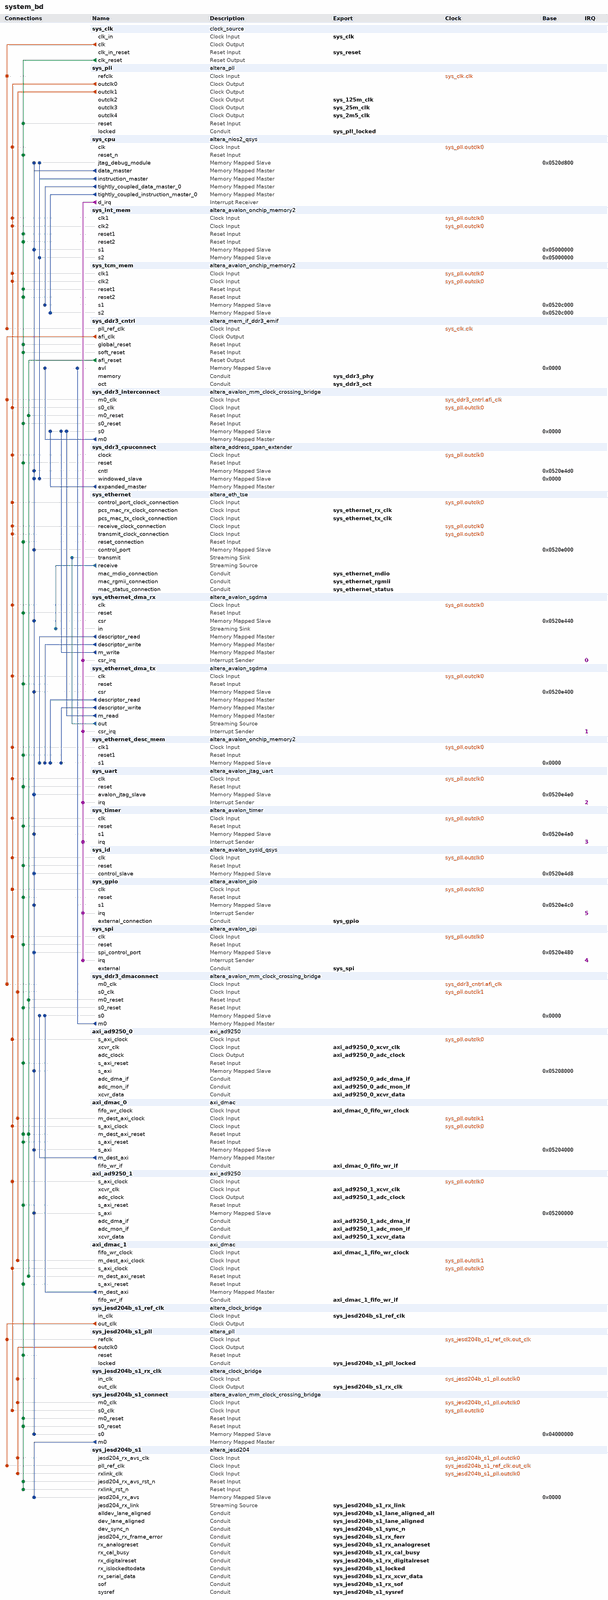
[diagram p0: system contents, whole]
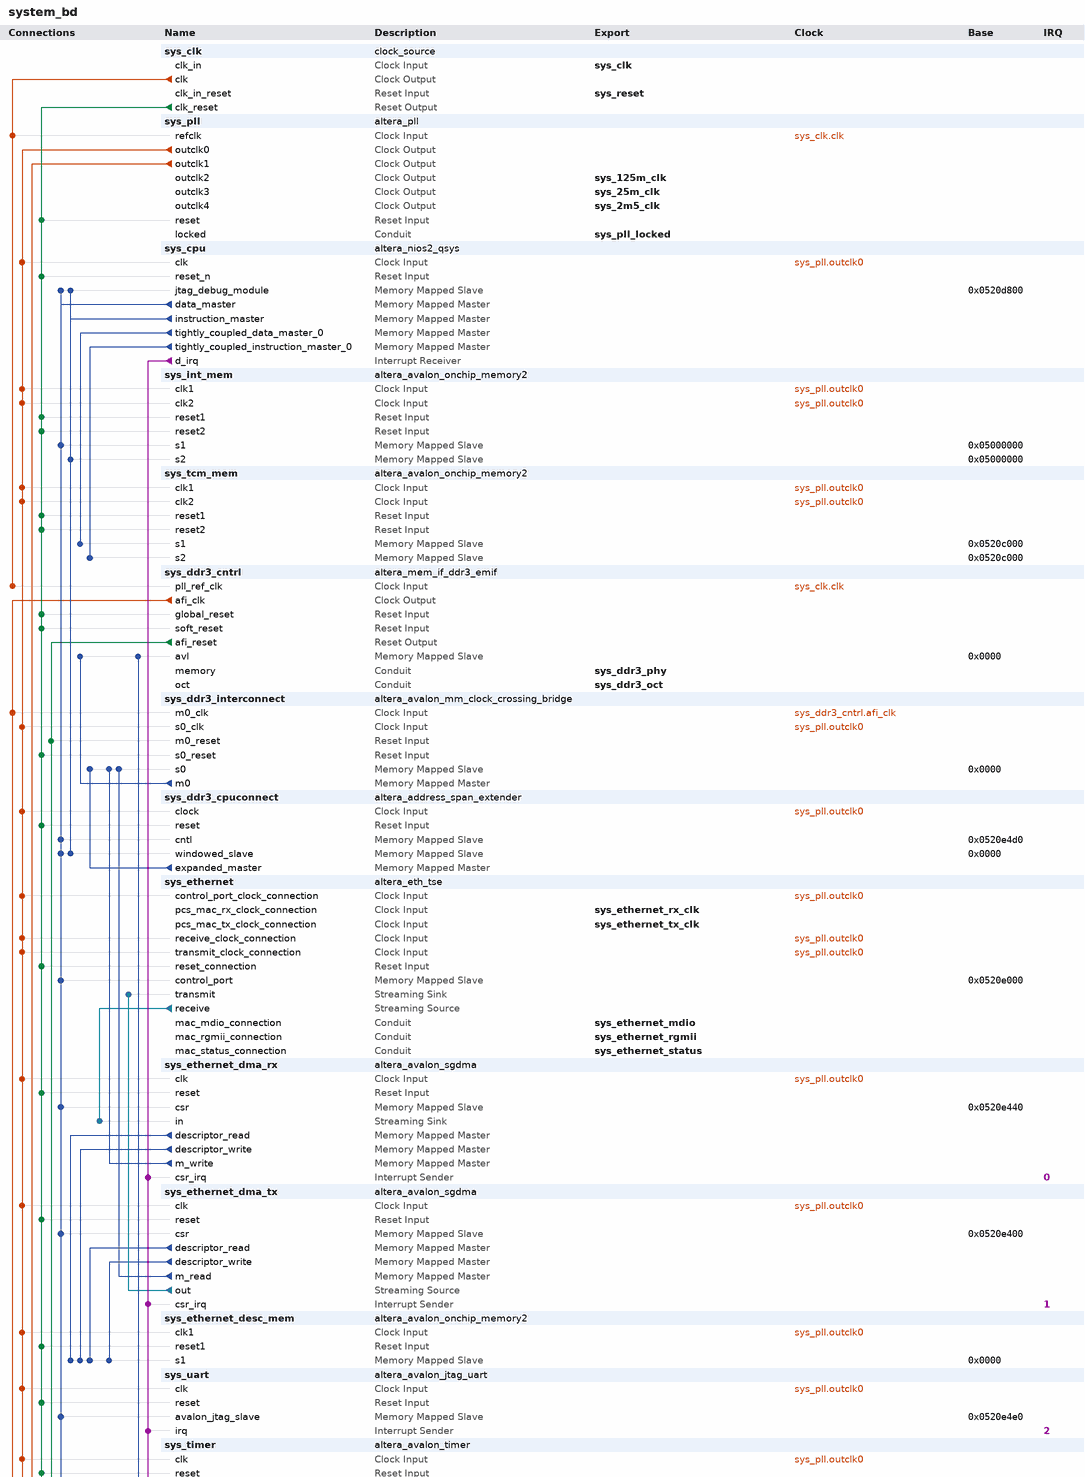
[diagram p1: system contents, upper part]
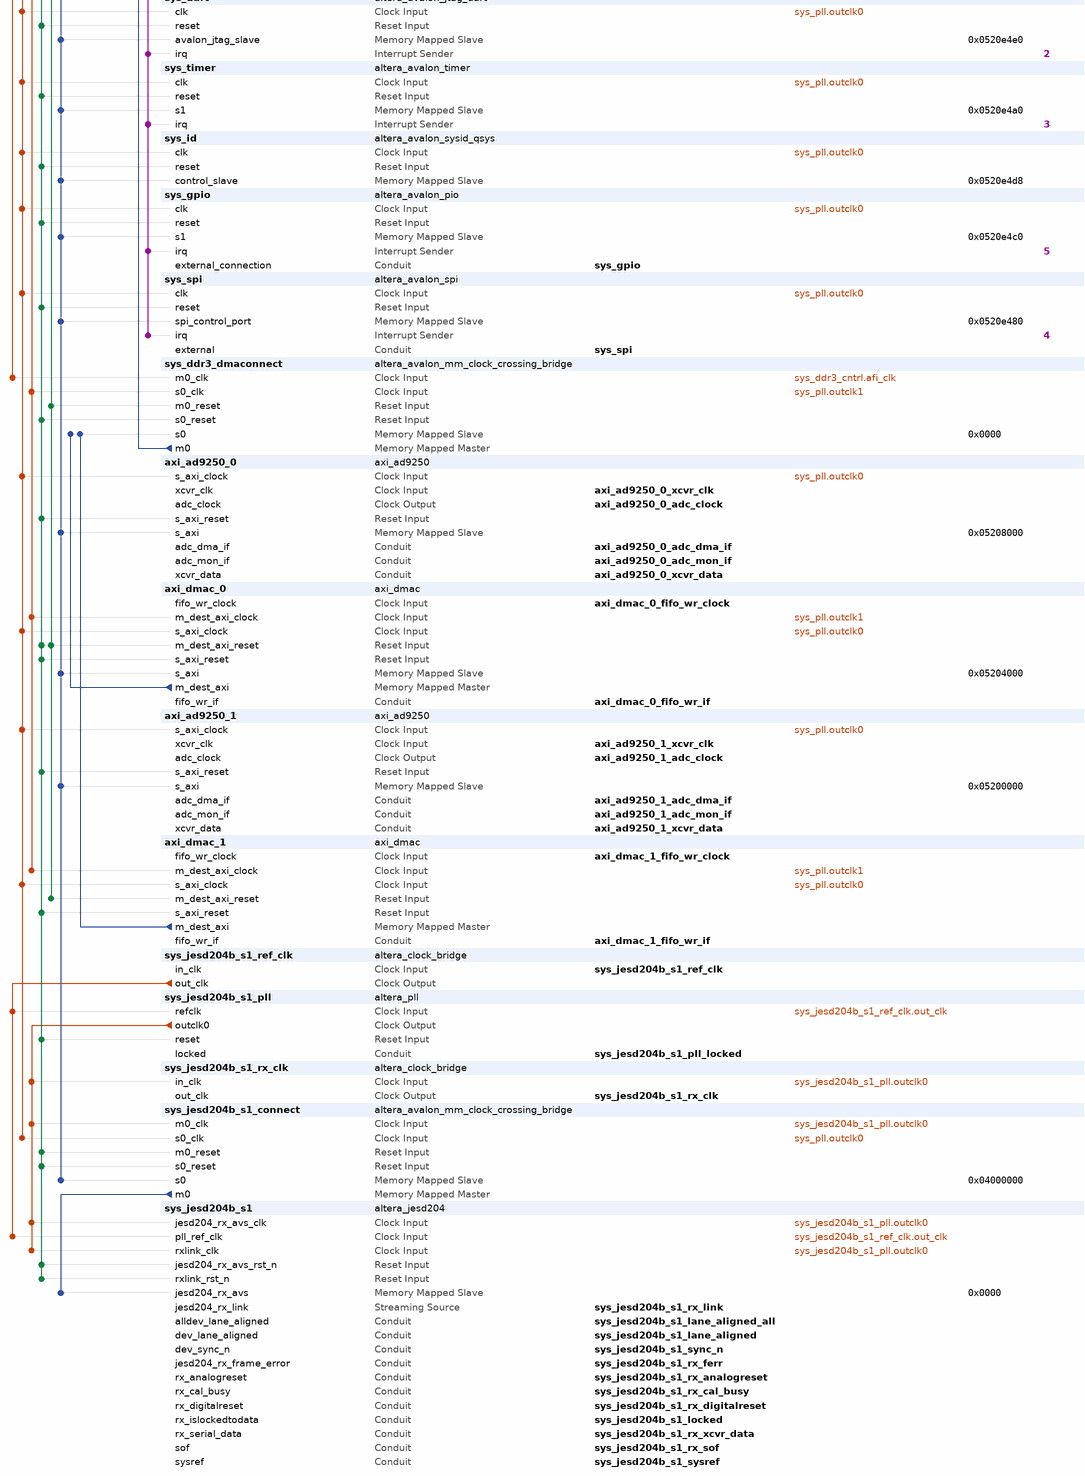
[diagram p2: system contents, lower part]
# Platform Designer (Qsys) system system_bd, Arria V 5AGTFD7K3F40I3
# Parameters at their usual value, and those the tool derives, are not listed.
package require -exact qsys 13.1
create_system system_bd
set_project_property DEVICE_FAMILY {Arria V}
set_project_property DEVICE 5AGTFD7K3F40I3

add_instance sys_clk clock_source 13.1
set_instance_parameter_value sys_clk clockFrequency 50000000

add_instance sys_pll altera_pll 13.1
set_instance_parameter_value sys_pll gui_device_speed_grade 2
set_instance_parameter_value sys_pll gui_pll_mode {Integer-N PLL}
set_instance_parameter_value sys_pll gui_reference_clock_frequency 100.0
set_instance_parameter_value sys_pll gui_operation_mode direct
set_instance_parameter_value sys_pll gui_use_locked true
set_instance_parameter_value sys_pll gui_number_of_clocks 5
set_instance_parameter_value sys_pll gui_output_clock_frequency0 100.0
set_instance_parameter_value sys_pll gui_output_clock_frequency1 166.666666
set_instance_parameter_value sys_pll gui_actual_output_clock_frequency1 {166.666666 MHz}
set_instance_parameter_value sys_pll gui_output_clock_frequency2 125.0
set_instance_parameter_value sys_pll gui_output_clock_frequency3 25.0

add_instance sys_cpu altera_nios2_qsys 13.1
set_instance_parameter_value sys_cpu mpu_enabled true
set_instance_parameter_value sys_cpu mmu_TLBMissExcOffset 4096
set_instance_parameter_value sys_cpu resetSlave sys_int_mem.s2
set_instance_parameter_value sys_cpu mmu_TLBMissExcSlave sys_int_mem.s2
set_instance_parameter_value sys_cpu exceptionSlave sys_int_mem.s2
set_instance_parameter_value sys_cpu breakSlave sys_cpu.jtag_debug_module
set_instance_parameter_value sys_cpu muldiv_multiplierType DSPBlock
set_instance_parameter_value sys_cpu impl Fast
set_instance_parameter_value sys_cpu icache_size 4096
set_instance_parameter_value sys_cpu icache_numTCIM 1
set_instance_parameter_value sys_cpu dcache_numTCDM 1

add_instance sys_int_mem altera_avalon_onchip_memory2 13.1
set_instance_parameter_value sys_int_mem dataWidth 32
set_instance_parameter_value sys_int_mem dualPort true
set_instance_parameter_value sys_int_mem initMemContent true
set_instance_parameter_value sys_int_mem initializationFileName onchip_mem.hex
set_instance_parameter_value sys_int_mem memorySize 1572864

add_instance sys_tcm_mem altera_avalon_onchip_memory2 13.1
set_instance_parameter_value sys_tcm_mem dataWidth 32
set_instance_parameter_value sys_tcm_mem dualPort true
set_instance_parameter_value sys_tcm_mem initMemContent true
set_instance_parameter_value sys_tcm_mem initializationFileName onchip_mem.hex
set_instance_parameter_value sys_tcm_mem memorySize 4096

add_instance sys_ddr3_cntrl altera_mem_if_ddr3_emif 13.1
set_instance_parameter_value sys_ddr3_cntrl MEM_VENDOR Micron
set_instance_parameter_value sys_ddr3_cntrl MEM_FORMAT DISCRETE
set_instance_parameter_value sys_ddr3_cntrl MEM_CLK_FREQ_MAX 800.0
set_instance_parameter_value sys_ddr3_cntrl MEM_ROW_ADDR_WIDTH 14
set_instance_parameter_value sys_ddr3_cntrl MEM_COL_ADDR_WIDTH 10
set_instance_parameter_value sys_ddr3_cntrl MEM_DQ_WIDTH 64
set_instance_parameter_value sys_ddr3_cntrl MEM_BANKADDR_WIDTH 3
set_instance_parameter_value sys_ddr3_cntrl MEM_DRV_STR RZQ/6
set_instance_parameter_value sys_ddr3_cntrl MEM_WTCL 8
set_instance_parameter_value sys_ddr3_cntrl MEM_TCL 11
set_instance_parameter_value sys_ddr3_cntrl TIMING_TIS 170
set_instance_parameter_value sys_ddr3_cntrl TIMING_TIH 120
set_instance_parameter_value sys_ddr3_cntrl TIMING_TDS 10
set_instance_parameter_value sys_ddr3_cntrl TIMING_TDH 45
set_instance_parameter_value sys_ddr3_cntrl TIMING_TDQSQ 100
set_instance_parameter_value sys_ddr3_cntrl TIMING_TDQSCK 255
set_instance_parameter_value sys_ddr3_cntrl TIMING_TDQSS 0.27
set_instance_parameter_value sys_ddr3_cntrl TIMING_TQSH 0.4
set_instance_parameter_value sys_ddr3_cntrl TIMING_TDSH 0.18
set_instance_parameter_value sys_ddr3_cntrl TIMING_TDSS 0.18
set_instance_parameter_value sys_ddr3_cntrl MEM_TRAS_NS 35.0
set_instance_parameter_value sys_ddr3_cntrl MEM_TRCD_NS 13.75
set_instance_parameter_value sys_ddr3_cntrl MEM_TRP_NS 13.75
set_instance_parameter_value sys_ddr3_cntrl MEM_TRFC_NS 110.0
set_instance_parameter_value sys_ddr3_cntrl MEM_TWTR 6
set_instance_parameter_value sys_ddr3_cntrl MEM_TFAW_NS 30.0
set_instance_parameter_value sys_ddr3_cntrl MEM_TRRD_NS 6.0
set_instance_parameter_value sys_ddr3_cntrl MEM_TRTP_NS 7.5
set_instance_parameter_value sys_ddr3_cntrl RATE Quarter
set_instance_parameter_value sys_ddr3_cntrl MEM_CLK_FREQ 400.0
set_instance_parameter_value sys_ddr3_cntrl SPEED_GRADE 3
set_instance_parameter_value sys_ddr3_cntrl HARD_EMIF false
set_instance_parameter_value sys_ddr3_cntrl POWER_OF_TWO_BUS false
set_instance_parameter_value sys_ddr3_cntrl AVL_MAX_SIZE 256
set_instance_parameter_value sys_ddr3_cntrl PRIORITY_PORT 1,1,1,1,1,1
set_instance_parameter_value sys_ddr3_cntrl CPORT_TYPE_PORT Bidirectional,Bidirectional,Bidirectional,Bidirectional,Bidirectional,Bidirectional
set_instance_parameter_value sys_ddr3_cntrl REF_CLK_FREQ 100.0
set_instance_parameter_value sys_ddr3_cntrl DEFAULT_FAST_SIM_MODEL true
set_instance_parameter_value sys_ddr3_cntrl EXPORT_AFI_HALF_CLK false
set_instance_parameter_value sys_ddr3_cntrl PLL_LOCATION Top_Bottom
set_instance_parameter_value sys_ddr3_cntrl CALIBRATION_MODE Skip
set_instance_parameter_value sys_ddr3_cntrl USER_DEBUG_LEVEL 1
set_instance_parameter_value sys_ddr3_cntrl TIMING_BOARD_MAX_CK_DELAY 0.6
set_instance_parameter_value sys_ddr3_cntrl TIMING_BOARD_MAX_DQS_DELAY 0.6
set_instance_parameter_value sys_ddr3_cntrl TIMING_BOARD_SKEW_CKDQS_DIMM_MIN -0.01
set_instance_parameter_value sys_ddr3_cntrl TIMING_BOARD_SKEW_CKDQS_DIMM_MAX 0.01
set_instance_parameter_value sys_ddr3_cntrl TIMING_BOARD_SKEW_WITHIN_DQS 0.02
set_instance_parameter_value sys_ddr3_cntrl TIMING_BOARD_SKEW_BETWEEN_DQS 0.02
set_instance_parameter_value sys_ddr3_cntrl TIMING_BOARD_DQ_TO_DQS_SKEW 0.0
set_instance_parameter_value sys_ddr3_cntrl TIMING_BOARD_AC_SKEW 0.02
set_instance_parameter_value sys_ddr3_cntrl TIMING_BOARD_AC_TO_CK_SKEW 0.0

add_instance sys_ddr3_interconnect altera_avalon_mm_clock_crossing_bridge 13.1
set_instance_parameter_value sys_ddr3_interconnect DATA_WIDTH 512
set_instance_parameter_value sys_ddr3_interconnect ADDRESS_WIDTH 30
set_instance_parameter_value sys_ddr3_interconnect MAX_BURST_SIZE 1
set_instance_parameter_value sys_ddr3_interconnect COMMAND_FIFO_DEPTH 4
set_instance_parameter_value sys_ddr3_interconnect RESPONSE_FIFO_DEPTH 4
set_instance_parameter_value sys_ddr3_interconnect MASTER_SYNC_DEPTH 2
set_instance_parameter_value sys_ddr3_interconnect SLAVE_SYNC_DEPTH 2

add_instance sys_ddr3_cpuconnect altera_address_span_extender 1.2
set_instance_parameter_value sys_ddr3_cpuconnect DATA_WIDTH 512
set_instance_parameter_value sys_ddr3_cpuconnect MASTER_ADDRESS_WIDTH 30
set_instance_parameter_value sys_ddr3_cpuconnect SLAVE_ADDRESS_WIDTH 20
set_instance_parameter_value sys_ddr3_cpuconnect BURSTCOUNT_WIDTH 1
set_instance_parameter_value sys_ddr3_cpuconnect MASTER_ADDRESS_DEF 0
set_instance_parameter_value sys_ddr3_cpuconnect TERMINATE_SLAVE_PORT false
set_instance_parameter_value sys_ddr3_cpuconnect MAX_PENDING_READS 1

add_instance sys_ethernet altera_eth_tse 13.1
set_instance_parameter_value sys_ethernet core_variation MAC_ONLY
set_instance_parameter_value sys_ethernet ifGMII RGMII
set_instance_parameter_value sys_ethernet transceiver_type NONE
set_instance_parameter_value sys_ethernet enable_hd_logic true
set_instance_parameter_value sys_ethernet stat_cnt_ena true
set_instance_parameter_value sys_ethernet enable_shift16 true
set_instance_parameter_value sys_ethernet enable_mac_flow_ctrl true
set_instance_parameter_value sys_ethernet enable_magic_detect true
set_instance_parameter_value sys_ethernet mdio_clk_div 30
set_instance_parameter_value sys_ethernet ing_addr 11

add_instance sys_ethernet_dma_rx altera_avalon_sgdma 13.1
set_instance_parameter_value sys_ethernet_dma_rx enableBurstTransfers false
set_instance_parameter_value sys_ethernet_dma_rx enableUnalignedTransfers false
set_instance_parameter_value sys_ethernet_dma_rx readBlockDataWidth 32
set_instance_parameter_value sys_ethernet_dma_rx sinkErrorWidth 0
set_instance_parameter_value sys_ethernet_dma_rx sourceErrorWidth 0
set_instance_parameter_value sys_ethernet_dma_rx transferMode STREAM_TO_MEMORY
set_instance_parameter_value sys_ethernet_dma_rx writeBurstcountWidth 4

add_instance sys_ethernet_dma_tx altera_avalon_sgdma 13.1
set_instance_parameter_value sys_ethernet_dma_tx enableBurstTransfers false
set_instance_parameter_value sys_ethernet_dma_tx enableUnalignedTransfers false
set_instance_parameter_value sys_ethernet_dma_tx readBlockDataWidth 32
set_instance_parameter_value sys_ethernet_dma_tx sinkErrorWidth 0
set_instance_parameter_value sys_ethernet_dma_tx sourceErrorWidth 0
set_instance_parameter_value sys_ethernet_dma_tx transferMode MEMORY_TO_STREAM
set_instance_parameter_value sys_ethernet_dma_tx writeBurstcountWidth 4

add_instance sys_ethernet_desc_mem altera_avalon_onchip_memory2 13.1
set_instance_parameter_value sys_ethernet_desc_mem dataWidth 32
set_instance_parameter_value sys_ethernet_desc_mem dualPort false
set_instance_parameter_value sys_ethernet_desc_mem initMemContent true
set_instance_parameter_value sys_ethernet_desc_mem initializationFileName onchip_mem.hex
set_instance_parameter_value sys_ethernet_desc_mem memorySize 4096

add_instance sys_uart altera_avalon_jtag_uart 13.1
set_instance_parameter_value sys_uart simInteractiveOptions NO_INTERACTIVE_WINDOWS

add_instance sys_timer altera_avalon_timer 13.1
set_instance_parameter_value sys_timer period 1
set_instance_parameter_value sys_timer periodUnits MSEC

add_instance sys_id altera_avalon_sysid_qsys 13.1
set_instance_parameter_value sys_id id 0

add_instance sys_gpio altera_avalon_pio 13.1
set_instance_parameter_value sys_gpio direction InOut
set_instance_parameter_value sys_gpio generateIRQ true
set_instance_parameter_value sys_gpio width 32

add_instance sys_spi altera_avalon_spi 13.1
set_instance_parameter_value sys_spi clockPolarity 0
set_instance_parameter_value sys_spi dataWidth 8
set_instance_parameter_value sys_spi masterSPI true
set_instance_parameter_value sys_spi numberOfSlaves 1
set_instance_parameter_value sys_spi targetClockRate 128000

add_instance sys_ddr3_dmaconnect altera_avalon_mm_clock_crossing_bridge 13.1
set_instance_parameter_value sys_ddr3_dmaconnect DATA_WIDTH 512
set_instance_parameter_value sys_ddr3_dmaconnect ADDRESS_WIDTH 30
set_instance_parameter_value sys_ddr3_dmaconnect MAX_BURST_SIZE 1
set_instance_parameter_value sys_ddr3_dmaconnect COMMAND_FIFO_DEPTH 4
set_instance_parameter_value sys_ddr3_dmaconnect RESPONSE_FIFO_DEPTH 4
set_instance_parameter_value sys_ddr3_dmaconnect MASTER_SYNC_DEPTH 2
set_instance_parameter_value sys_ddr3_dmaconnect SLAVE_SYNC_DEPTH 2

add_instance axi_ad9250_0 axi_ad9250 1.0
set_instance_parameter_value axi_ad9250_0 PCORE_ID 0
set_instance_parameter_value axi_ad9250_0 PCORE_DEVICE_TYPE 0

add_instance axi_dmac_0 axi_dmac 1.0
set_instance_parameter_value axi_dmac_0 PCORE_ID 0
set_instance_parameter_value axi_dmac_0 C_DMA_DATA_WIDTH_SRC 64
set_instance_parameter_value axi_dmac_0 C_DMA_DATA_WIDTH_DEST 64
set_instance_parameter_value axi_dmac_0 C_ADDR_ALIGN_BITS 3
set_instance_parameter_value axi_dmac_0 C_DMA_LENGTH_WIDTH 14
set_instance_parameter_value axi_dmac_0 C_2D_TRANSFER 1
set_instance_parameter_value axi_dmac_0 C_CLKS_ASYNC_REQ_SRC 1
set_instance_parameter_value axi_dmac_0 C_CLKS_ASYNC_SRC_DEST 1
set_instance_parameter_value axi_dmac_0 C_CLKS_ASYNC_DEST_REQ 1
set_instance_parameter_value axi_dmac_0 C_AXI_SLICE_DEST 0
set_instance_parameter_value axi_dmac_0 C_AXI_SLICE_SRC 0
set_instance_parameter_value axi_dmac_0 C_SYNC_TRANSFER_START 0
set_instance_parameter_value axi_dmac_0 C_CYCLIC 1
set_instance_parameter_value axi_dmac_0 C_DMA_TYPE_DEST 0
set_instance_parameter_value axi_dmac_0 C_DMA_TYPE_SRC 2

add_instance axi_ad9250_1 axi_ad9250 1.0
set_instance_parameter_value axi_ad9250_1 PCORE_ID 1
set_instance_parameter_value axi_ad9250_1 PCORE_DEVICE_TYPE 0

add_instance axi_dmac_1 axi_dmac 1.0
set_instance_parameter_value axi_dmac_1 PCORE_ID 1
set_instance_parameter_value axi_dmac_1 C_DMA_DATA_WIDTH_SRC 64
set_instance_parameter_value axi_dmac_1 C_DMA_DATA_WIDTH_DEST 64
set_instance_parameter_value axi_dmac_1 C_ADDR_ALIGN_BITS 3
set_instance_parameter_value axi_dmac_1 C_DMA_LENGTH_WIDTH 14
set_instance_parameter_value axi_dmac_1 C_2D_TRANSFER 1
set_instance_parameter_value axi_dmac_1 C_CLKS_ASYNC_REQ_SRC 1
set_instance_parameter_value axi_dmac_1 C_CLKS_ASYNC_SRC_DEST 1
set_instance_parameter_value axi_dmac_1 C_CLKS_ASYNC_DEST_REQ 1
set_instance_parameter_value axi_dmac_1 C_AXI_SLICE_DEST 0
set_instance_parameter_value axi_dmac_1 C_AXI_SLICE_SRC 0
set_instance_parameter_value axi_dmac_1 C_SYNC_TRANSFER_START 0
set_instance_parameter_value axi_dmac_1 C_CYCLIC 1
set_instance_parameter_value axi_dmac_1 C_DMA_TYPE_DEST 0
set_instance_parameter_value axi_dmac_1 C_DMA_TYPE_SRC 2

add_instance sys_jesd204b_s1_ref_clk altera_clock_bridge 13.1
set_instance_parameter_value sys_jesd204b_s1_ref_clk DERIVED_CLOCK_RATE 0
set_instance_parameter_value sys_jesd204b_s1_ref_clk EXPLICIT_CLOCK_RATE 0

add_instance sys_jesd204b_s1_pll altera_pll 13.1
set_instance_parameter_value sys_jesd204b_s1_pll gui_device_speed_grade 2
set_instance_parameter_value sys_jesd204b_s1_pll gui_pll_mode {Integer-N PLL}
set_instance_parameter_value sys_jesd204b_s1_pll gui_reference_clock_frequency 250.0
set_instance_parameter_value sys_jesd204b_s1_pll gui_operation_mode direct
set_instance_parameter_value sys_jesd204b_s1_pll gui_use_locked true
set_instance_parameter_value sys_jesd204b_s1_pll gui_number_of_clocks 1
set_instance_parameter_value sys_jesd204b_s1_pll gui_output_clock_frequency0 125.0

add_instance sys_jesd204b_s1_rx_clk altera_clock_bridge 13.1
set_instance_parameter_value sys_jesd204b_s1_rx_clk DERIVED_CLOCK_RATE 125000000
set_instance_parameter_value sys_jesd204b_s1_rx_clk EXPLICIT_CLOCK_RATE 0

add_instance sys_jesd204b_s1_connect altera_avalon_mm_clock_crossing_bridge 13.1
set_instance_parameter_value sys_jesd204b_s1_connect DATA_WIDTH 32
set_instance_parameter_value sys_jesd204b_s1_connect ADDRESS_WIDTH 10
set_instance_parameter_value sys_jesd204b_s1_connect MAX_BURST_SIZE 1
set_instance_parameter_value sys_jesd204b_s1_connect COMMAND_FIFO_DEPTH 4
set_instance_parameter_value sys_jesd204b_s1_connect RESPONSE_FIFO_DEPTH 4
set_instance_parameter_value sys_jesd204b_s1_connect MASTER_SYNC_DEPTH 2
set_instance_parameter_value sys_jesd204b_s1_connect SLAVE_SYNC_DEPTH 2

add_instance sys_jesd204b_s1 altera_jesd204 13.1
set_instance_parameter_value sys_jesd204b_s1 wrapper_opt base_phy
set_instance_parameter_value sys_jesd204b_s1 sdc_constraint 1.0
set_instance_parameter_value sys_jesd204b_s1 DATA_PATH RX
set_instance_parameter_value sys_jesd204b_s1 SUBCLASSV 1
set_instance_parameter_value sys_jesd204b_s1 lane_rate 5000
set_instance_parameter_value sys_jesd204b_s1 pll_type CMU
set_instance_parameter_value sys_jesd204b_s1 bonded_mode bonded
set_instance_parameter_value sys_jesd204b_s1 REFCLK_FREQ 250.0
set_instance_parameter_value sys_jesd204b_s1 pll_reconfig_enable false
set_instance_parameter_value sys_jesd204b_s1 bitrev_en false
set_instance_parameter_value sys_jesd204b_s1 L 4
set_instance_parameter_value sys_jesd204b_s1 M 4
set_instance_parameter_value sys_jesd204b_s1 N 16
set_instance_parameter_value sys_jesd204b_s1 N_PRIME 16
set_instance_parameter_value sys_jesd204b_s1 S 1
set_instance_parameter_value sys_jesd204b_s1 K 32
set_instance_parameter_value sys_jesd204b_s1 SCR 1
set_instance_parameter_value sys_jesd204b_s1 CS 0
set_instance_parameter_value sys_jesd204b_s1 CF 0
set_instance_parameter_value sys_jesd204b_s1 HD 0
set_instance_parameter_value sys_jesd204b_s1 ECC_EN 0
set_instance_parameter_value sys_jesd204b_s1 DLB_TEST 0
set_instance_parameter_value sys_jesd204b_s1 PHADJ 0
set_instance_parameter_value sys_jesd204b_s1 ADJCNT 0
set_instance_parameter_value sys_jesd204b_s1 ADJDIR 0
set_instance_parameter_value sys_jesd204b_s1 OPTIMIZE 0
set_instance_parameter_value sys_jesd204b_s1 DID 0
set_instance_parameter_value sys_jesd204b_s1 BID 0
set_instance_parameter_value sys_jesd204b_s1 LID0 0
set_instance_parameter_value sys_jesd204b_s1 LID1 1
set_instance_parameter_value sys_jesd204b_s1 LID2 2
set_instance_parameter_value sys_jesd204b_s1 LID3 3
set_instance_parameter_value sys_jesd204b_s1 LID4 4
set_instance_parameter_value sys_jesd204b_s1 LID5 5
set_instance_parameter_value sys_jesd204b_s1 LID6 6
set_instance_parameter_value sys_jesd204b_s1 LID7 7
set_instance_parameter_value sys_jesd204b_s1 JESDV 1
set_instance_parameter_value sys_jesd204b_s1 RES1 0
set_instance_parameter_value sys_jesd204b_s1 RES2 0
set_instance_parameter_value sys_jesd204b_s1 TEST_COMPONENTS_EN false
set_instance_parameter_value sys_jesd204b_s1 TERMINATE_RECONFIG_EN false

# connections
add_connection sys_clk.clk sys_ddr3_cntrl.pll_ref_clk clock
add_connection sys_clk.clk sys_pll.refclk clock
add_connection sys_ddr3_cntrl.afi_clk sys_ddr3_dmaconnect.m0_clk clock
add_connection sys_ddr3_cntrl.afi_clk sys_ddr3_interconnect.m0_clk clock
add_connection sys_jesd204b_s1_pll.outclk0 sys_jesd204b_s1.jesd204_rx_avs_clk clock
add_connection sys_jesd204b_s1_pll.outclk0 sys_jesd204b_s1.rxlink_clk clock
add_connection sys_jesd204b_s1_pll.outclk0 sys_jesd204b_s1_connect.m0_clk clock
add_connection sys_jesd204b_s1_pll.outclk0 sys_jesd204b_s1_rx_clk.in_clk clock
add_connection sys_jesd204b_s1_ref_clk.out_clk sys_jesd204b_s1.pll_ref_clk clock
add_connection sys_jesd204b_s1_ref_clk.out_clk sys_jesd204b_s1_pll.refclk clock
add_connection sys_pll.outclk0 axi_ad9250_0.s_axi_clock clock
add_connection sys_pll.outclk0 axi_ad9250_1.s_axi_clock clock
add_connection sys_pll.outclk0 axi_dmac_0.s_axi_clock clock
add_connection sys_pll.outclk0 axi_dmac_1.s_axi_clock clock
add_connection sys_pll.outclk0 sys_cpu.clk clock
add_connection sys_pll.outclk0 sys_ddr3_cpuconnect.clock clock
add_connection sys_pll.outclk0 sys_ddr3_interconnect.s0_clk clock
add_connection sys_pll.outclk0 sys_ethernet.control_port_clock_connection clock
add_connection sys_pll.outclk0 sys_ethernet.receive_clock_connection clock
add_connection sys_pll.outclk0 sys_ethernet.transmit_clock_connection clock
add_connection sys_pll.outclk0 sys_ethernet_desc_mem.clk1 clock
add_connection sys_pll.outclk0 sys_ethernet_dma_rx.clk clock
add_connection sys_pll.outclk0 sys_ethernet_dma_tx.clk clock
add_connection sys_pll.outclk0 sys_gpio.clk clock
add_connection sys_pll.outclk0 sys_id.clk clock
add_connection sys_pll.outclk0 sys_int_mem.clk1 clock
add_connection sys_pll.outclk0 sys_int_mem.clk2 clock
add_connection sys_pll.outclk0 sys_jesd204b_s1_connect.s0_clk clock
add_connection sys_pll.outclk0 sys_spi.clk clock
add_connection sys_pll.outclk0 sys_tcm_mem.clk1 clock
add_connection sys_pll.outclk0 sys_tcm_mem.clk2 clock
add_connection sys_pll.outclk0 sys_timer.clk clock
add_connection sys_pll.outclk0 sys_uart.clk clock
add_connection sys_pll.outclk1 axi_dmac_0.m_dest_axi_clock clock
add_connection sys_pll.outclk1 axi_dmac_1.m_dest_axi_clock clock
add_connection sys_pll.outclk1 sys_ddr3_dmaconnect.s0_clk clock
add_connection sys_clk.clk_reset axi_ad9250_0.s_axi_reset reset
add_connection sys_clk.clk_reset axi_ad9250_1.s_axi_reset reset
add_connection sys_clk.clk_reset axi_dmac_0.m_dest_axi_reset reset
add_connection sys_clk.clk_reset axi_dmac_0.s_axi_reset reset
add_connection sys_clk.clk_reset axi_dmac_1.s_axi_reset reset
add_connection sys_clk.clk_reset sys_cpu.reset_n reset
add_connection sys_clk.clk_reset sys_ddr3_cntrl.global_reset reset
add_connection sys_clk.clk_reset sys_ddr3_cntrl.soft_reset reset
add_connection sys_clk.clk_reset sys_ddr3_cpuconnect.reset reset
add_connection sys_clk.clk_reset sys_ddr3_dmaconnect.s0_reset reset
add_connection sys_clk.clk_reset sys_ddr3_interconnect.s0_reset reset
add_connection sys_clk.clk_reset sys_ethernet.reset_connection reset
add_connection sys_clk.clk_reset sys_ethernet_desc_mem.reset1 reset
add_connection sys_clk.clk_reset sys_ethernet_dma_rx.reset reset
add_connection sys_clk.clk_reset sys_ethernet_dma_tx.reset reset
add_connection sys_clk.clk_reset sys_gpio.reset reset
add_connection sys_clk.clk_reset sys_id.reset reset
add_connection sys_clk.clk_reset sys_int_mem.reset1 reset
add_connection sys_clk.clk_reset sys_int_mem.reset2 reset
add_connection sys_clk.clk_reset sys_jesd204b_s1.jesd204_rx_avs_rst_n reset
add_connection sys_clk.clk_reset sys_jesd204b_s1.rxlink_rst_n reset
add_connection sys_clk.clk_reset sys_jesd204b_s1_connect.m0_reset reset
add_connection sys_clk.clk_reset sys_jesd204b_s1_connect.s0_reset reset
add_connection sys_clk.clk_reset sys_jesd204b_s1_pll.reset reset
add_connection sys_clk.clk_reset sys_pll.reset reset
add_connection sys_clk.clk_reset sys_spi.reset reset
add_connection sys_clk.clk_reset sys_tcm_mem.reset1 reset
add_connection sys_clk.clk_reset sys_tcm_mem.reset2 reset
add_connection sys_clk.clk_reset sys_timer.reset reset
add_connection sys_clk.clk_reset sys_uart.reset reset
add_connection sys_ddr3_cntrl.afi_reset axi_dmac_0.m_dest_axi_reset reset
add_connection sys_ddr3_cntrl.afi_reset axi_dmac_1.m_dest_axi_reset reset
add_connection sys_ddr3_cntrl.afi_reset sys_ddr3_dmaconnect.m0_reset reset
add_connection sys_ddr3_cntrl.afi_reset sys_ddr3_interconnect.m0_reset reset
add_connection axi_dmac_0.m_dest_axi sys_ddr3_dmaconnect.s0 avalon
set_connection_parameter_value axi_dmac_0.m_dest_axi/sys_ddr3_dmaconnect.s0 baseAddress 0x0000
add_connection axi_dmac_1.m_dest_axi sys_ddr3_dmaconnect.s0 avalon
set_connection_parameter_value axi_dmac_1.m_dest_axi/sys_ddr3_dmaconnect.s0 baseAddress 0x0000
add_connection sys_cpu.data_master axi_ad9250_0.s_axi avalon
set_connection_parameter_value sys_cpu.data_master/axi_ad9250_0.s_axi baseAddress 0x05208000
add_connection sys_cpu.data_master axi_ad9250_1.s_axi avalon
set_connection_parameter_value sys_cpu.data_master/axi_ad9250_1.s_axi baseAddress 0x05200000
add_connection sys_cpu.data_master axi_dmac_0.s_axi avalon
set_connection_parameter_value sys_cpu.data_master/axi_dmac_0.s_axi baseAddress 0x05204000
add_connection sys_cpu.data_master sys_cpu.jtag_debug_module avalon
set_connection_parameter_value sys_cpu.data_master/sys_cpu.jtag_debug_module baseAddress 0x0520d800
add_connection sys_cpu.data_master sys_ddr3_cpuconnect.cntl avalon
set_connection_parameter_value sys_cpu.data_master/sys_ddr3_cpuconnect.cntl baseAddress 0x0520e4d0
add_connection sys_cpu.data_master sys_ddr3_cpuconnect.windowed_slave avalon
set_connection_parameter_value sys_cpu.data_master/sys_ddr3_cpuconnect.windowed_slave baseAddress 0x0000
add_connection sys_cpu.data_master sys_ethernet.control_port avalon
set_connection_parameter_value sys_cpu.data_master/sys_ethernet.control_port baseAddress 0x0520e000
add_connection sys_cpu.data_master sys_ethernet_dma_rx.csr avalon
set_connection_parameter_value sys_cpu.data_master/sys_ethernet_dma_rx.csr baseAddress 0x0520e440
add_connection sys_cpu.data_master sys_ethernet_dma_tx.csr avalon
set_connection_parameter_value sys_cpu.data_master/sys_ethernet_dma_tx.csr baseAddress 0x0520e400
add_connection sys_cpu.data_master sys_gpio.s1 avalon
set_connection_parameter_value sys_cpu.data_master/sys_gpio.s1 baseAddress 0x0520e4c0
add_connection sys_cpu.data_master sys_id.control_slave avalon
set_connection_parameter_value sys_cpu.data_master/sys_id.control_slave baseAddress 0x0520e4d8
add_connection sys_cpu.data_master sys_int_mem.s1 avalon
set_connection_parameter_value sys_cpu.data_master/sys_int_mem.s1 baseAddress 0x05000000
add_connection sys_cpu.data_master sys_jesd204b_s1_connect.s0 avalon
set_connection_parameter_value sys_cpu.data_master/sys_jesd204b_s1_connect.s0 baseAddress 0x04000000
add_connection sys_cpu.data_master sys_spi.spi_control_port avalon
set_connection_parameter_value sys_cpu.data_master/sys_spi.spi_control_port baseAddress 0x0520e480
add_connection sys_cpu.data_master sys_timer.s1 avalon
set_connection_parameter_value sys_cpu.data_master/sys_timer.s1 baseAddress 0x0520e4a0
add_connection sys_cpu.data_master sys_uart.avalon_jtag_slave avalon
set_connection_parameter_value sys_cpu.data_master/sys_uart.avalon_jtag_slave baseAddress 0x0520e4e0
add_connection sys_cpu.instruction_master sys_cpu.jtag_debug_module avalon
set_connection_parameter_value sys_cpu.instruction_master/sys_cpu.jtag_debug_module baseAddress 0x0520d800
add_connection sys_cpu.instruction_master sys_ddr3_cpuconnect.windowed_slave avalon
set_connection_parameter_value sys_cpu.instruction_master/sys_ddr3_cpuconnect.windowed_slave baseAddress 0x0000
add_connection sys_cpu.instruction_master sys_int_mem.s2 avalon
set_connection_parameter_value sys_cpu.instruction_master/sys_int_mem.s2 baseAddress 0x05000000
add_connection sys_cpu.tightly_coupled_data_master_0 sys_tcm_mem.s1 avalon
set_connection_parameter_value sys_cpu.tightly_coupled_data_master_0/sys_tcm_mem.s1 baseAddress 0x0520c000
add_connection sys_cpu.tightly_coupled_instruction_master_0 sys_tcm_mem.s2 avalon
set_connection_parameter_value sys_cpu.tightly_coupled_instruction_master_0/sys_tcm_mem.s2 baseAddress 0x0520c000
add_connection sys_ddr3_cpuconnect.expanded_master sys_ddr3_interconnect.s0 avalon
set_connection_parameter_value sys_ddr3_cpuconnect.expanded_master/sys_ddr3_interconnect.s0 baseAddress 0x0000
add_connection sys_ddr3_dmaconnect.m0 sys_ddr3_cntrl.avl avalon
set_connection_parameter_value sys_ddr3_dmaconnect.m0/sys_ddr3_cntrl.avl baseAddress 0x0000
add_connection sys_ddr3_interconnect.m0 sys_ddr3_cntrl.avl avalon
set_connection_parameter_value sys_ddr3_interconnect.m0/sys_ddr3_cntrl.avl baseAddress 0x0000
add_connection sys_ethernet_dma_rx.descriptor_read sys_ethernet_desc_mem.s1 avalon
set_connection_parameter_value sys_ethernet_dma_rx.descriptor_read/sys_ethernet_desc_mem.s1 baseAddress 0x0000
add_connection sys_ethernet_dma_rx.descriptor_write sys_ethernet_desc_mem.s1 avalon
set_connection_parameter_value sys_ethernet_dma_rx.descriptor_write/sys_ethernet_desc_mem.s1 baseAddress 0x0000
add_connection sys_ethernet_dma_rx.m_write sys_ddr3_interconnect.s0 avalon
set_connection_parameter_value sys_ethernet_dma_rx.m_write/sys_ddr3_interconnect.s0 baseAddress 0x0000
add_connection sys_ethernet_dma_tx.descriptor_read sys_ethernet_desc_mem.s1 avalon
set_connection_parameter_value sys_ethernet_dma_tx.descriptor_read/sys_ethernet_desc_mem.s1 baseAddress 0x0000
add_connection sys_ethernet_dma_tx.descriptor_write sys_ethernet_desc_mem.s1 avalon
set_connection_parameter_value sys_ethernet_dma_tx.descriptor_write/sys_ethernet_desc_mem.s1 baseAddress 0x0000
add_connection sys_ethernet_dma_tx.m_read sys_ddr3_interconnect.s0 avalon
set_connection_parameter_value sys_ethernet_dma_tx.m_read/sys_ddr3_interconnect.s0 baseAddress 0x0000
add_connection sys_jesd204b_s1_connect.m0 sys_jesd204b_s1.jesd204_rx_avs avalon
set_connection_parameter_value sys_jesd204b_s1_connect.m0/sys_jesd204b_s1.jesd204_rx_avs baseAddress 0x0000
add_connection sys_ethernet.receive sys_ethernet_dma_rx.in avalon_streaming
add_connection sys_ethernet_dma_tx.out sys_ethernet.transmit avalon_streaming
add_connection sys_cpu.d_irq sys_ethernet_dma_rx.csr_irq interrupt
set_connection_parameter_value sys_cpu.d_irq/sys_ethernet_dma_rx.csr_irq irqNumber 0
add_connection sys_cpu.d_irq sys_ethernet_dma_tx.csr_irq interrupt
set_connection_parameter_value sys_cpu.d_irq/sys_ethernet_dma_tx.csr_irq irqNumber 1
add_connection sys_cpu.d_irq sys_gpio.irq interrupt
set_connection_parameter_value sys_cpu.d_irq/sys_gpio.irq irqNumber 5
add_connection sys_cpu.d_irq sys_spi.irq interrupt
set_connection_parameter_value sys_cpu.d_irq/sys_spi.irq irqNumber 4
add_connection sys_cpu.d_irq sys_timer.irq interrupt
set_connection_parameter_value sys_cpu.d_irq/sys_timer.irq irqNumber 3
add_connection sys_cpu.d_irq sys_uart.irq interrupt
set_connection_parameter_value sys_cpu.d_irq/sys_uart.irq irqNumber 2

# exported interfaces
add_interface sys_clk clock sink
set_interface_property sys_clk EXPORT_OF sys_clk.clk_in
add_interface sys_reset reset sink
set_interface_property sys_reset EXPORT_OF sys_clk.clk_in_reset
add_interface sys_125m_clk clock source
set_interface_property sys_125m_clk EXPORT_OF sys_pll.outclk2
add_interface sys_25m_clk clock source
set_interface_property sys_25m_clk EXPORT_OF sys_pll.outclk3
add_interface sys_2m5_clk clock source
set_interface_property sys_2m5_clk EXPORT_OF sys_pll.outclk4
add_interface sys_ddr3_phy conduit end
set_interface_property sys_ddr3_phy EXPORT_OF sys_ddr3_cntrl.memory
add_interface sys_ddr3_oct conduit end
set_interface_property sys_ddr3_oct EXPORT_OF sys_ddr3_cntrl.oct
add_interface sys_ethernet_tx_clk clock sink
set_interface_property sys_ethernet_tx_clk EXPORT_OF sys_ethernet.pcs_mac_tx_clock_connection
add_interface sys_ethernet_rx_clk clock sink
set_interface_property sys_ethernet_rx_clk EXPORT_OF sys_ethernet.pcs_mac_rx_clock_connection
add_interface sys_ethernet_status conduit end
set_interface_property sys_ethernet_status EXPORT_OF sys_ethernet.mac_status_connection
add_interface sys_ethernet_rgmii conduit end
set_interface_property sys_ethernet_rgmii EXPORT_OF sys_ethernet.mac_rgmii_connection
add_interface sys_ethernet_mdio conduit end
set_interface_property sys_ethernet_mdio EXPORT_OF sys_ethernet.mac_mdio_connection
add_interface sys_gpio conduit end
set_interface_property sys_gpio EXPORT_OF sys_gpio.external_connection
add_interface sys_spi conduit end
set_interface_property sys_spi EXPORT_OF sys_spi.external
add_interface axi_ad9250_0_xcvr_clk clock sink
set_interface_property axi_ad9250_0_xcvr_clk EXPORT_OF axi_ad9250_0.xcvr_clk
add_interface axi_ad9250_0_xcvr_data conduit end
set_interface_property axi_ad9250_0_xcvr_data EXPORT_OF axi_ad9250_0.xcvr_data
add_interface axi_ad9250_0_adc_clock clock source
set_interface_property axi_ad9250_0_adc_clock EXPORT_OF axi_ad9250_0.adc_clock
add_interface axi_ad9250_0_adc_dma_if conduit end
set_interface_property axi_ad9250_0_adc_dma_if EXPORT_OF axi_ad9250_0.adc_dma_if
add_interface axi_ad9250_0_adc_mon_if conduit end
set_interface_property axi_ad9250_0_adc_mon_if EXPORT_OF axi_ad9250_0.adc_mon_if
add_interface axi_dmac_0_fifo_wr_clock clock sink
set_interface_property axi_dmac_0_fifo_wr_clock EXPORT_OF axi_dmac_0.fifo_wr_clock
add_interface axi_dmac_0_fifo_wr_if conduit end
set_interface_property axi_dmac_0_fifo_wr_if EXPORT_OF axi_dmac_0.fifo_wr_if
add_interface axi_ad9250_1_xcvr_clk clock sink
set_interface_property axi_ad9250_1_xcvr_clk EXPORT_OF axi_ad9250_1.xcvr_clk
add_interface axi_ad9250_1_xcvr_data conduit end
set_interface_property axi_ad9250_1_xcvr_data EXPORT_OF axi_ad9250_1.xcvr_data
add_interface axi_ad9250_1_adc_clock clock source
set_interface_property axi_ad9250_1_adc_clock EXPORT_OF axi_ad9250_1.adc_clock
add_interface axi_ad9250_1_adc_dma_if conduit end
set_interface_property axi_ad9250_1_adc_dma_if EXPORT_OF axi_ad9250_1.adc_dma_if
add_interface axi_ad9250_1_adc_mon_if conduit end
set_interface_property axi_ad9250_1_adc_mon_if EXPORT_OF axi_ad9250_1.adc_mon_if
add_interface axi_dmac_1_fifo_wr_clock clock sink
set_interface_property axi_dmac_1_fifo_wr_clock EXPORT_OF axi_dmac_1.fifo_wr_clock
add_interface axi_dmac_1_fifo_wr_if conduit end
set_interface_property axi_dmac_1_fifo_wr_if EXPORT_OF axi_dmac_1.fifo_wr_if
add_interface sys_jesd204b_s1_rx_link avalon_streaming source
set_interface_property sys_jesd204b_s1_rx_link EXPORT_OF sys_jesd204b_s1.jesd204_rx_link
add_interface sys_jesd204b_s1_lane_aligned_all conduit end
set_interface_property sys_jesd204b_s1_lane_aligned_all EXPORT_OF sys_jesd204b_s1.alldev_lane_aligned
add_interface sys_jesd204b_s1_sysref conduit end
set_interface_property sys_jesd204b_s1_sysref EXPORT_OF sys_jesd204b_s1.sysref
add_interface sys_jesd204b_s1_rx_ferr conduit end
set_interface_property sys_jesd204b_s1_rx_ferr EXPORT_OF sys_jesd204b_s1.jesd204_rx_frame_error
add_interface sys_jesd204b_s1_lane_aligned conduit end
set_interface_property sys_jesd204b_s1_lane_aligned EXPORT_OF sys_jesd204b_s1.dev_lane_aligned
add_interface sys_jesd204b_s1_sync_n conduit end
set_interface_property sys_jesd204b_s1_sync_n EXPORT_OF sys_jesd204b_s1.dev_sync_n
add_interface sys_jesd204b_s1_rx_sof conduit end
set_interface_property sys_jesd204b_s1_rx_sof EXPORT_OF sys_jesd204b_s1.sof
add_interface sys_jesd204b_s1_rx_xcvr_data conduit end
set_interface_property sys_jesd204b_s1_rx_xcvr_data EXPORT_OF sys_jesd204b_s1.rx_serial_data
add_interface sys_jesd204b_s1_rx_analogreset conduit end
set_interface_property sys_jesd204b_s1_rx_analogreset EXPORT_OF sys_jesd204b_s1.rx_analogreset
add_interface sys_jesd204b_s1_rx_digitalreset conduit end
set_interface_property sys_jesd204b_s1_rx_digitalreset EXPORT_OF sys_jesd204b_s1.rx_digitalreset
add_interface sys_jesd204b_s1_locked conduit end
set_interface_property sys_jesd204b_s1_locked EXPORT_OF sys_jesd204b_s1.rx_islockedtodata
add_interface sys_jesd204b_s1_rx_cal_busy conduit end
set_interface_property sys_jesd204b_s1_rx_cal_busy EXPORT_OF sys_jesd204b_s1.rx_cal_busy
add_interface sys_jesd204b_s1_ref_clk clock sink
set_interface_property sys_jesd204b_s1_ref_clk EXPORT_OF sys_jesd204b_s1_ref_clk.in_clk
add_interface sys_jesd204b_s1_rx_clk clock source
set_interface_property sys_jesd204b_s1_rx_clk EXPORT_OF sys_jesd204b_s1_rx_clk.out_clk
add_interface sys_jesd204b_s1_pll_locked conduit end
set_interface_property sys_jesd204b_s1_pll_locked EXPORT_OF sys_jesd204b_s1_pll.locked
add_interface sys_pll_locked conduit end
set_interface_property sys_pll_locked EXPORT_OF sys_pll.locked

set_interconnect_requirement {$system} qsys_mm.clockCrossingAdapter FIFO
set_interconnect_requirement {$system} qsys_mm.maxAdditionalLatency 2
set_interconnect_requirement {$system} qsys_mm.insertDefaultSlave false

save_system system_bd.qsys
